# EAGLE schematic untitled (EAGLE 8.3.2)
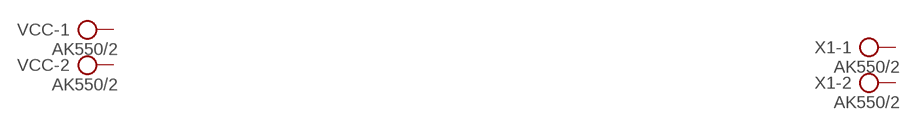
[diagram p0: schematic, sheet 1]

## Parts
VCC  AK550/2  [AK550/2]
X1  AK550/2  [AK550/2]
Unconnected: VCC.1 VCC.2 X1.1 X1.2

## Library data of the parts
VCC X1 = con-ptr500:AK550/2: CONNECTOR; OC_FARNELL: unknown; OC_NEWARK: unknown